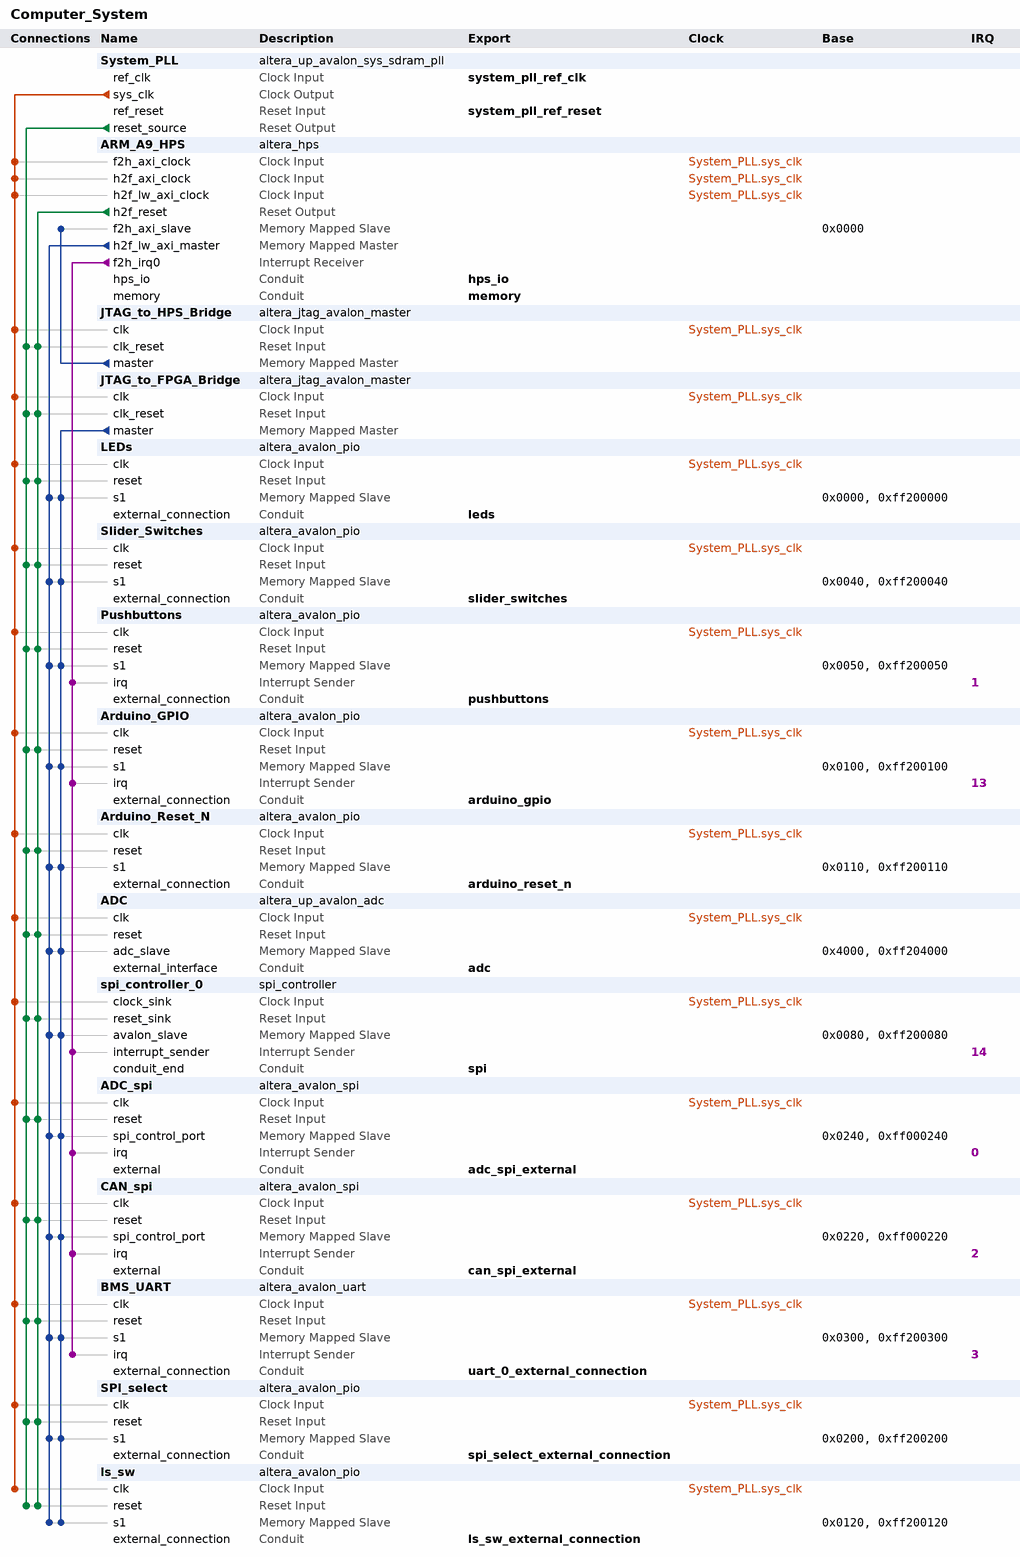
[diagram p0: system contents]
# Platform Designer (Qsys) system Computer_System, Cyclone V 5CSEMA4U23C6
# Parameters at their usual value, and those the tool derives, are not listed.
package require -exact qsys 16.0
create_system Computer_System
set_project_property DEVICE_FAMILY {Cyclone V}
set_project_property DEVICE 5CSEMA4U23C6

add_instance System_PLL altera_up_avalon_sys_sdram_pll 15.1
set_instance_parameter_value System_PLL CV_boards DE0-Nano-SoC
set_instance_parameter_value System_PLL gui_outclk 100.0
set_instance_parameter_value System_PLL gui_refclk 50.0

add_instance ARM_A9_HPS altera_hps 16.0
set_instance_parameter_value ARM_A9_HPS EMAC1_Mode RGMII
set_instance_parameter_value ARM_A9_HPS EMAC1_PinMuxing {HPS I/O Set 0}
set_instance_parameter_value ARM_A9_HPS F2SCLK_COLDRST_Enable false
set_instance_parameter_value ARM_A9_HPS F2SCLK_DBGRST_Enable false
set_instance_parameter_value ARM_A9_HPS F2SCLK_WARMRST_Enable false
set_instance_parameter_value ARM_A9_HPS F2SINTERRUPT_Enable true
set_instance_parameter_value ARM_A9_HPS F2S_Width 2
set_instance_parameter_value ARM_A9_HPS FPGA_PERIPHERAL_OUTPUT_CLOCK_FREQ_EMAC0_GTX_CLK 125
set_instance_parameter_value ARM_A9_HPS FPGA_PERIPHERAL_OUTPUT_CLOCK_FREQ_EMAC0_MD_CLK 100.0
set_instance_parameter_value ARM_A9_HPS FPGA_PERIPHERAL_OUTPUT_CLOCK_FREQ_EMAC1_GTX_CLK 125
set_instance_parameter_value ARM_A9_HPS FPGA_PERIPHERAL_OUTPUT_CLOCK_FREQ_EMAC1_MD_CLK 100.0
set_instance_parameter_value ARM_A9_HPS HPS_PROTOCOL DDR3
set_instance_parameter_value ARM_A9_HPS I2C0_Mode I2C
set_instance_parameter_value ARM_A9_HPS I2C0_PinMuxing {HPS I/O Set 0}
set_instance_parameter_value ARM_A9_HPS I2C1_Mode I2C
set_instance_parameter_value ARM_A9_HPS I2C1_PinMuxing {HPS I/O Set 0}
set_instance_parameter_value ARM_A9_HPS LWH2F_Enable true
set_instance_parameter_value ARM_A9_HPS MEM_BANKADDR_WIDTH 3
set_instance_parameter_value ARM_A9_HPS MEM_CLK_FREQ 400.0
set_instance_parameter_value ARM_A9_HPS MEM_COL_ADDR_WIDTH 10
set_instance_parameter_value ARM_A9_HPS MEM_DQ_WIDTH 32
set_instance_parameter_value ARM_A9_HPS MEM_DRV_STR RZQ/6
set_instance_parameter_value ARM_A9_HPS MEM_ROW_ADDR_WIDTH 15
set_instance_parameter_value ARM_A9_HPS MEM_RTT_NOM RZQ/6
set_instance_parameter_value ARM_A9_HPS MEM_RTT_WR {Dynamic ODT off}
set_instance_parameter_value ARM_A9_HPS MEM_TCL 7
set_instance_parameter_value ARM_A9_HPS MEM_TFAW_NS 37.5
set_instance_parameter_value ARM_A9_HPS MEM_TRAS_NS 35.0
set_instance_parameter_value ARM_A9_HPS MEM_TRCD_NS 13.75
set_instance_parameter_value ARM_A9_HPS MEM_TRFC_NS 300.0
set_instance_parameter_value ARM_A9_HPS MEM_TRP_NS 13.75
set_instance_parameter_value ARM_A9_HPS MEM_VENDOR JEDEC
set_instance_parameter_value ARM_A9_HPS MEM_WTCL 7
set_instance_parameter_value ARM_A9_HPS QSPI_Mode N/A
set_instance_parameter_value ARM_A9_HPS QSPI_PinMuxing Unused
set_instance_parameter_value ARM_A9_HPS REF_CLK_FREQ 25.0
set_instance_parameter_value ARM_A9_HPS S2FCLK_USER2CLK 5
set_instance_parameter_value ARM_A9_HPS S2F_Width 3
set_instance_parameter_value ARM_A9_HPS SDIO_Mode {4-bit Data}
set_instance_parameter_value ARM_A9_HPS SDIO_PinMuxing {HPS I/O Set 0}
set_instance_parameter_value ARM_A9_HPS SPIM1_Mode {Single Slave Select}
set_instance_parameter_value ARM_A9_HPS SPIM1_PinMuxing {HPS I/O Set 0}
set_instance_parameter_value ARM_A9_HPS STM_Enable false
set_instance_parameter_value ARM_A9_HPS TIMING_BOARD_AC_SKEW 0.02
set_instance_parameter_value ARM_A9_HPS TIMING_BOARD_AC_TO_CK_SKEW 0.0
set_instance_parameter_value ARM_A9_HPS TIMING_BOARD_DQ_TO_DQS_SKEW 0.0
set_instance_parameter_value ARM_A9_HPS TIMING_BOARD_MAX_CK_DELAY 0.6
set_instance_parameter_value ARM_A9_HPS TIMING_BOARD_MAX_DQS_DELAY 0.6
set_instance_parameter_value ARM_A9_HPS TIMING_BOARD_SKEW_BETWEEN_DQS 0.02
set_instance_parameter_value ARM_A9_HPS TIMING_BOARD_SKEW_CKDQS_DIMM_MAX 0.01
set_instance_parameter_value ARM_A9_HPS TIMING_BOARD_SKEW_CKDQS_DIMM_MIN -0.01
set_instance_parameter_value ARM_A9_HPS TIMING_BOARD_SKEW_WITHIN_DQS 0.02
set_instance_parameter_value ARM_A9_HPS TIMING_TDH 125
set_instance_parameter_value ARM_A9_HPS TIMING_TDQSCK 400
set_instance_parameter_value ARM_A9_HPS TIMING_TDQSQ 120
set_instance_parameter_value ARM_A9_HPS TIMING_TDS 50
set_instance_parameter_value ARM_A9_HPS TIMING_TIH 250
set_instance_parameter_value ARM_A9_HPS TIMING_TIS 175
set_instance_parameter_value ARM_A9_HPS TIMING_TQSH 0.38
set_instance_parameter_value ARM_A9_HPS UART0_Mode {No Flow Control}
set_instance_parameter_value ARM_A9_HPS UART0_PinMuxing {HPS I/O Set 0}
set_instance_parameter_value ARM_A9_HPS USB1_Mode SDR
set_instance_parameter_value ARM_A9_HPS USB1_PinMuxing {HPS I/O Set 0}
set_instance_parameter_value ARM_A9_HPS desired_cfg_clk_mhz 100.0
set_instance_parameter_value ARM_A9_HPS desired_qspi_clk_mhz 400.0
set_instance_parameter_value ARM_A9_HPS use_default_mpu_clk false

add_instance JTAG_to_HPS_Bridge altera_jtag_avalon_master 16.0

add_instance JTAG_to_FPGA_Bridge altera_jtag_avalon_master 16.0

add_instance LEDs altera_avalon_pio 16.0
set_instance_parameter_value LEDs direction Output
set_instance_parameter_value LEDs width 8

add_instance Slider_Switches altera_avalon_pio 16.0
set_instance_parameter_value Slider_Switches direction Input
set_instance_parameter_value Slider_Switches simDoTestBenchWiring true
set_instance_parameter_value Slider_Switches width 4

add_instance Pushbuttons altera_avalon_pio 16.0
set_instance_parameter_value Pushbuttons bitClearingEdgeCapReg true
set_instance_parameter_value Pushbuttons captureEdge true
set_instance_parameter_value Pushbuttons direction Input
set_instance_parameter_value Pushbuttons edgeType FALLING
set_instance_parameter_value Pushbuttons generateIRQ true
set_instance_parameter_value Pushbuttons irqType EDGE
set_instance_parameter_value Pushbuttons simDoTestBenchWiring true
set_instance_parameter_value Pushbuttons width 2

add_instance Arduino_GPIO altera_avalon_pio 16.0
set_instance_parameter_value Arduino_GPIO bitClearingEdgeCapReg true
set_instance_parameter_value Arduino_GPIO captureEdge true
set_instance_parameter_value Arduino_GPIO direction Bidir
set_instance_parameter_value Arduino_GPIO edgeType FALLING
set_instance_parameter_value Arduino_GPIO generateIRQ true
set_instance_parameter_value Arduino_GPIO irqType EDGE
set_instance_parameter_value Arduino_GPIO simDoTestBenchWiring true
set_instance_parameter_value Arduino_GPIO width 16

add_instance Arduino_Reset_N altera_avalon_pio 16.0
set_instance_parameter_value Arduino_Reset_N bitClearingEdgeCapReg true
set_instance_parameter_value Arduino_Reset_N captureEdge true
set_instance_parameter_value Arduino_Reset_N direction Output
set_instance_parameter_value Arduino_Reset_N edgeType FALLING
set_instance_parameter_value Arduino_Reset_N generateIRQ true
set_instance_parameter_value Arduino_Reset_N irqType EDGE
set_instance_parameter_value Arduino_Reset_N simDoTestBenchWiring true
set_instance_parameter_value Arduino_Reset_N width 1

add_instance ADC altera_up_avalon_adc 15.1
set_instance_parameter_value ADC board DE0-Nano-SoC
set_instance_parameter_value ADC numch_ 8

add_instance spi_controller_0 spi_controller 1.0

add_instance ADC_spi altera_avalon_spi 16.0
set_instance_parameter_value ADC_spi clockPolarity 0
set_instance_parameter_value ADC_spi dataWidth 16
set_instance_parameter_value ADC_spi insertDelayBetweenSlaveSelectAndSClk true
set_instance_parameter_value ADC_spi masterSPI true
set_instance_parameter_value ADC_spi numberOfSlaves 2
set_instance_parameter_value ADC_spi targetClockRate 10000000
set_instance_parameter_value ADC_spi targetSlaveSelectToSClkDelay 15.0

add_instance CAN_spi altera_avalon_spi 16.0
set_instance_parameter_value CAN_spi clockPolarity 0
set_instance_parameter_value CAN_spi dataWidth 24
set_instance_parameter_value CAN_spi insertDelayBetweenSlaveSelectAndSClk true
set_instance_parameter_value CAN_spi masterSPI true
set_instance_parameter_value CAN_spi numberOfSlaves 3
set_instance_parameter_value CAN_spi targetClockRate 8000000
set_instance_parameter_value CAN_spi targetSlaveSelectToSClkDelay 20.0

add_instance BMS_UART altera_avalon_uart 16.0
set_instance_parameter_value BMS_UART baud 9600
set_instance_parameter_value BMS_UART dataBits 8
set_instance_parameter_value BMS_UART fixedBaud true
set_instance_parameter_value BMS_UART parity EVEN
set_instance_parameter_value BMS_UART stopBits 1

add_instance SPI_select altera_avalon_pio 16.0
set_instance_parameter_value SPI_select direction Output
set_instance_parameter_value SPI_select width 8

add_instance ls_sw altera_avalon_pio 16.0
set_instance_parameter_value ls_sw direction Output
set_instance_parameter_value ls_sw width 12

# connections
add_connection System_PLL.sys_clk ADC.clk clock
add_connection System_PLL.sys_clk ADC_spi.clk clock
add_connection System_PLL.sys_clk Arduino_GPIO.clk clock
add_connection System_PLL.sys_clk Arduino_Reset_N.clk clock
add_connection System_PLL.sys_clk ARM_A9_HPS.f2h_axi_clock clock
add_connection System_PLL.sys_clk ARM_A9_HPS.h2f_axi_clock clock
add_connection System_PLL.sys_clk ARM_A9_HPS.h2f_lw_axi_clock clock
add_connection System_PLL.sys_clk BMS_UART.clk clock
add_connection System_PLL.sys_clk CAN_spi.clk clock
add_connection System_PLL.sys_clk JTAG_to_FPGA_Bridge.clk clock
add_connection System_PLL.sys_clk JTAG_to_HPS_Bridge.clk clock
add_connection System_PLL.sys_clk LEDs.clk clock
add_connection System_PLL.sys_clk ls_sw.clk clock
add_connection System_PLL.sys_clk Pushbuttons.clk clock
add_connection System_PLL.sys_clk Slider_Switches.clk clock
add_connection System_PLL.sys_clk spi_controller_0.clock_sink clock
add_connection System_PLL.sys_clk SPI_select.clk clock
add_connection ARM_A9_HPS.h2f_reset ADC.reset reset
add_connection ARM_A9_HPS.h2f_reset ADC_spi.reset reset
add_connection ARM_A9_HPS.h2f_reset Arduino_GPIO.reset reset
add_connection ARM_A9_HPS.h2f_reset Arduino_Reset_N.reset reset
add_connection ARM_A9_HPS.h2f_reset BMS_UART.reset reset
add_connection ARM_A9_HPS.h2f_reset CAN_spi.reset reset
add_connection ARM_A9_HPS.h2f_reset JTAG_to_FPGA_Bridge.clk_reset reset
add_connection ARM_A9_HPS.h2f_reset JTAG_to_HPS_Bridge.clk_reset reset
add_connection ARM_A9_HPS.h2f_reset LEDs.reset reset
add_connection ARM_A9_HPS.h2f_reset ls_sw.reset reset
add_connection ARM_A9_HPS.h2f_reset Pushbuttons.reset reset
add_connection ARM_A9_HPS.h2f_reset Slider_Switches.reset reset
add_connection ARM_A9_HPS.h2f_reset spi_controller_0.reset_sink reset
add_connection ARM_A9_HPS.h2f_reset SPI_select.reset reset
add_connection System_PLL.reset_source ADC.reset reset
add_connection System_PLL.reset_source ADC_spi.reset reset
add_connection System_PLL.reset_source Arduino_GPIO.reset reset
add_connection System_PLL.reset_source Arduino_Reset_N.reset reset
add_connection System_PLL.reset_source BMS_UART.reset reset
add_connection System_PLL.reset_source CAN_spi.reset reset
add_connection System_PLL.reset_source JTAG_to_FPGA_Bridge.clk_reset reset
add_connection System_PLL.reset_source JTAG_to_HPS_Bridge.clk_reset reset
add_connection System_PLL.reset_source LEDs.reset reset
add_connection System_PLL.reset_source ls_sw.reset reset
add_connection System_PLL.reset_source Pushbuttons.reset reset
add_connection System_PLL.reset_source Slider_Switches.reset reset
add_connection System_PLL.reset_source spi_controller_0.reset_sink reset
add_connection System_PLL.reset_source SPI_select.reset reset
add_connection ARM_A9_HPS.h2f_lw_axi_master ADC.adc_slave avalon
set_connection_parameter_value ARM_A9_HPS.h2f_lw_axi_master/ADC.adc_slave baseAddress 0x4000
add_connection ARM_A9_HPS.h2f_lw_axi_master ADC_spi.spi_control_port avalon
set_connection_parameter_value ARM_A9_HPS.h2f_lw_axi_master/ADC_spi.spi_control_port baseAddress 0x0240
add_connection ARM_A9_HPS.h2f_lw_axi_master Arduino_GPIO.s1 avalon
set_connection_parameter_value ARM_A9_HPS.h2f_lw_axi_master/Arduino_GPIO.s1 baseAddress 0x0100
add_connection ARM_A9_HPS.h2f_lw_axi_master Arduino_Reset_N.s1 avalon
set_connection_parameter_value ARM_A9_HPS.h2f_lw_axi_master/Arduino_Reset_N.s1 baseAddress 0x0110
add_connection ARM_A9_HPS.h2f_lw_axi_master BMS_UART.s1 avalon
set_connection_parameter_value ARM_A9_HPS.h2f_lw_axi_master/BMS_UART.s1 baseAddress 0x0300
add_connection ARM_A9_HPS.h2f_lw_axi_master CAN_spi.spi_control_port avalon
set_connection_parameter_value ARM_A9_HPS.h2f_lw_axi_master/CAN_spi.spi_control_port baseAddress 0x0220
add_connection ARM_A9_HPS.h2f_lw_axi_master LEDs.s1 avalon
set_connection_parameter_value ARM_A9_HPS.h2f_lw_axi_master/LEDs.s1 baseAddress 0x0000
add_connection ARM_A9_HPS.h2f_lw_axi_master ls_sw.s1 avalon
set_connection_parameter_value ARM_A9_HPS.h2f_lw_axi_master/ls_sw.s1 baseAddress 0x0120
add_connection ARM_A9_HPS.h2f_lw_axi_master Pushbuttons.s1 avalon
set_connection_parameter_value ARM_A9_HPS.h2f_lw_axi_master/Pushbuttons.s1 baseAddress 0x0050
add_connection ARM_A9_HPS.h2f_lw_axi_master Slider_Switches.s1 avalon
set_connection_parameter_value ARM_A9_HPS.h2f_lw_axi_master/Slider_Switches.s1 baseAddress 0x0040
add_connection ARM_A9_HPS.h2f_lw_axi_master spi_controller_0.avalon_slave avalon
set_connection_parameter_value ARM_A9_HPS.h2f_lw_axi_master/spi_controller_0.avalon_slave baseAddress 0x0080
add_connection ARM_A9_HPS.h2f_lw_axi_master SPI_select.s1 avalon
set_connection_parameter_value ARM_A9_HPS.h2f_lw_axi_master/SPI_select.s1 baseAddress 0x0200
add_connection JTAG_to_FPGA_Bridge.master ADC.adc_slave avalon
set_connection_parameter_value JTAG_to_FPGA_Bridge.master/ADC.adc_slave baseAddress 0xff204000
add_connection JTAG_to_FPGA_Bridge.master ADC_spi.spi_control_port avalon
set_connection_parameter_value JTAG_to_FPGA_Bridge.master/ADC_spi.spi_control_port baseAddress 0xff000240
add_connection JTAG_to_FPGA_Bridge.master Arduino_GPIO.s1 avalon
set_connection_parameter_value JTAG_to_FPGA_Bridge.master/Arduino_GPIO.s1 baseAddress 0xff200100
add_connection JTAG_to_FPGA_Bridge.master Arduino_Reset_N.s1 avalon
set_connection_parameter_value JTAG_to_FPGA_Bridge.master/Arduino_Reset_N.s1 baseAddress 0xff200110
add_connection JTAG_to_FPGA_Bridge.master BMS_UART.s1 avalon
set_connection_parameter_value JTAG_to_FPGA_Bridge.master/BMS_UART.s1 baseAddress 0xff200300
add_connection JTAG_to_FPGA_Bridge.master CAN_spi.spi_control_port avalon
set_connection_parameter_value JTAG_to_FPGA_Bridge.master/CAN_spi.spi_control_port baseAddress 0xff000220
add_connection JTAG_to_FPGA_Bridge.master LEDs.s1 avalon
set_connection_parameter_value JTAG_to_FPGA_Bridge.master/LEDs.s1 baseAddress 0xff200000
add_connection JTAG_to_FPGA_Bridge.master ls_sw.s1 avalon
set_connection_parameter_value JTAG_to_FPGA_Bridge.master/ls_sw.s1 baseAddress 0xff200120
add_connection JTAG_to_FPGA_Bridge.master Pushbuttons.s1 avalon
set_connection_parameter_value JTAG_to_FPGA_Bridge.master/Pushbuttons.s1 baseAddress 0xff200050
add_connection JTAG_to_FPGA_Bridge.master Slider_Switches.s1 avalon
set_connection_parameter_value JTAG_to_FPGA_Bridge.master/Slider_Switches.s1 baseAddress 0xff200040
add_connection JTAG_to_FPGA_Bridge.master spi_controller_0.avalon_slave avalon
set_connection_parameter_value JTAG_to_FPGA_Bridge.master/spi_controller_0.avalon_slave baseAddress 0xff200080
add_connection JTAG_to_FPGA_Bridge.master SPI_select.s1 avalon
set_connection_parameter_value JTAG_to_FPGA_Bridge.master/SPI_select.s1 baseAddress 0xff200200
add_connection JTAG_to_HPS_Bridge.master ARM_A9_HPS.f2h_axi_slave avalon
set_connection_parameter_value JTAG_to_HPS_Bridge.master/ARM_A9_HPS.f2h_axi_slave baseAddress 0x0000
add_connection ARM_A9_HPS.f2h_irq0 ADC_spi.irq interrupt
set_connection_parameter_value ARM_A9_HPS.f2h_irq0/ADC_spi.irq irqNumber 0
add_connection ARM_A9_HPS.f2h_irq0 Arduino_GPIO.irq interrupt
set_connection_parameter_value ARM_A9_HPS.f2h_irq0/Arduino_GPIO.irq irqNumber 13
add_connection ARM_A9_HPS.f2h_irq0 BMS_UART.irq interrupt
set_connection_parameter_value ARM_A9_HPS.f2h_irq0/BMS_UART.irq irqNumber 3
add_connection ARM_A9_HPS.f2h_irq0 CAN_spi.irq interrupt
set_connection_parameter_value ARM_A9_HPS.f2h_irq0/CAN_spi.irq irqNumber 2
add_connection ARM_A9_HPS.f2h_irq0 Pushbuttons.irq interrupt
set_connection_parameter_value ARM_A9_HPS.f2h_irq0/Pushbuttons.irq irqNumber 1
add_connection ARM_A9_HPS.f2h_irq0 spi_controller_0.interrupt_sender interrupt
set_connection_parameter_value ARM_A9_HPS.f2h_irq0/spi_controller_0.interrupt_sender irqNumber 14

# exported interfaces
add_interface adc conduit end
set_interface_property adc EXPORT_OF ADC.external_interface
add_interface adc_spi_external conduit end
set_interface_property adc_spi_external EXPORT_OF ADC_spi.external
add_interface arduino_gpio conduit end
set_interface_property arduino_gpio EXPORT_OF Arduino_GPIO.external_connection
add_interface arduino_reset_n conduit end
set_interface_property arduino_reset_n EXPORT_OF Arduino_Reset_N.external_connection
add_interface can_spi_external conduit end
set_interface_property can_spi_external EXPORT_OF CAN_spi.external
add_interface hps_io conduit end
set_interface_property hps_io EXPORT_OF ARM_A9_HPS.hps_io
add_interface leds conduit end
set_interface_property leds EXPORT_OF LEDs.external_connection
add_interface ls_sw_external_connection conduit end
set_interface_property ls_sw_external_connection EXPORT_OF ls_sw.external_connection
add_interface memory conduit end
set_interface_property memory EXPORT_OF ARM_A9_HPS.memory
add_interface pushbuttons conduit end
set_interface_property pushbuttons EXPORT_OF Pushbuttons.external_connection
add_interface slider_switches conduit end
set_interface_property slider_switches EXPORT_OF Slider_Switches.external_connection
add_interface spi conduit end
set_interface_property spi EXPORT_OF spi_controller_0.conduit_end
add_interface spi_select_external_connection conduit end
set_interface_property spi_select_external_connection EXPORT_OF SPI_select.external_connection
add_interface system_pll_ref_clk clock sink
set_interface_property system_pll_ref_clk EXPORT_OF System_PLL.ref_clk
add_interface system_pll_ref_reset reset sink
set_interface_property system_pll_ref_reset EXPORT_OF System_PLL.ref_reset
add_interface uart_0_external_connection conduit end
set_interface_property uart_0_external_connection EXPORT_OF BMS_UART.external_connection

set_interconnect_requirement {$system} qsys_mm.clockCrossingAdapter HANDSHAKE
set_interconnect_requirement {$system} qsys_mm.enableEccProtection FALSE
set_interconnect_requirement {$system} qsys_mm.insertDefaultSlave FALSE
set_interconnect_requirement {$system} qsys_mm.maxAdditionalLatency 1

save_system Computer_System.qsys
